# EAGLE design wifi-test (EAGLE 6.2)
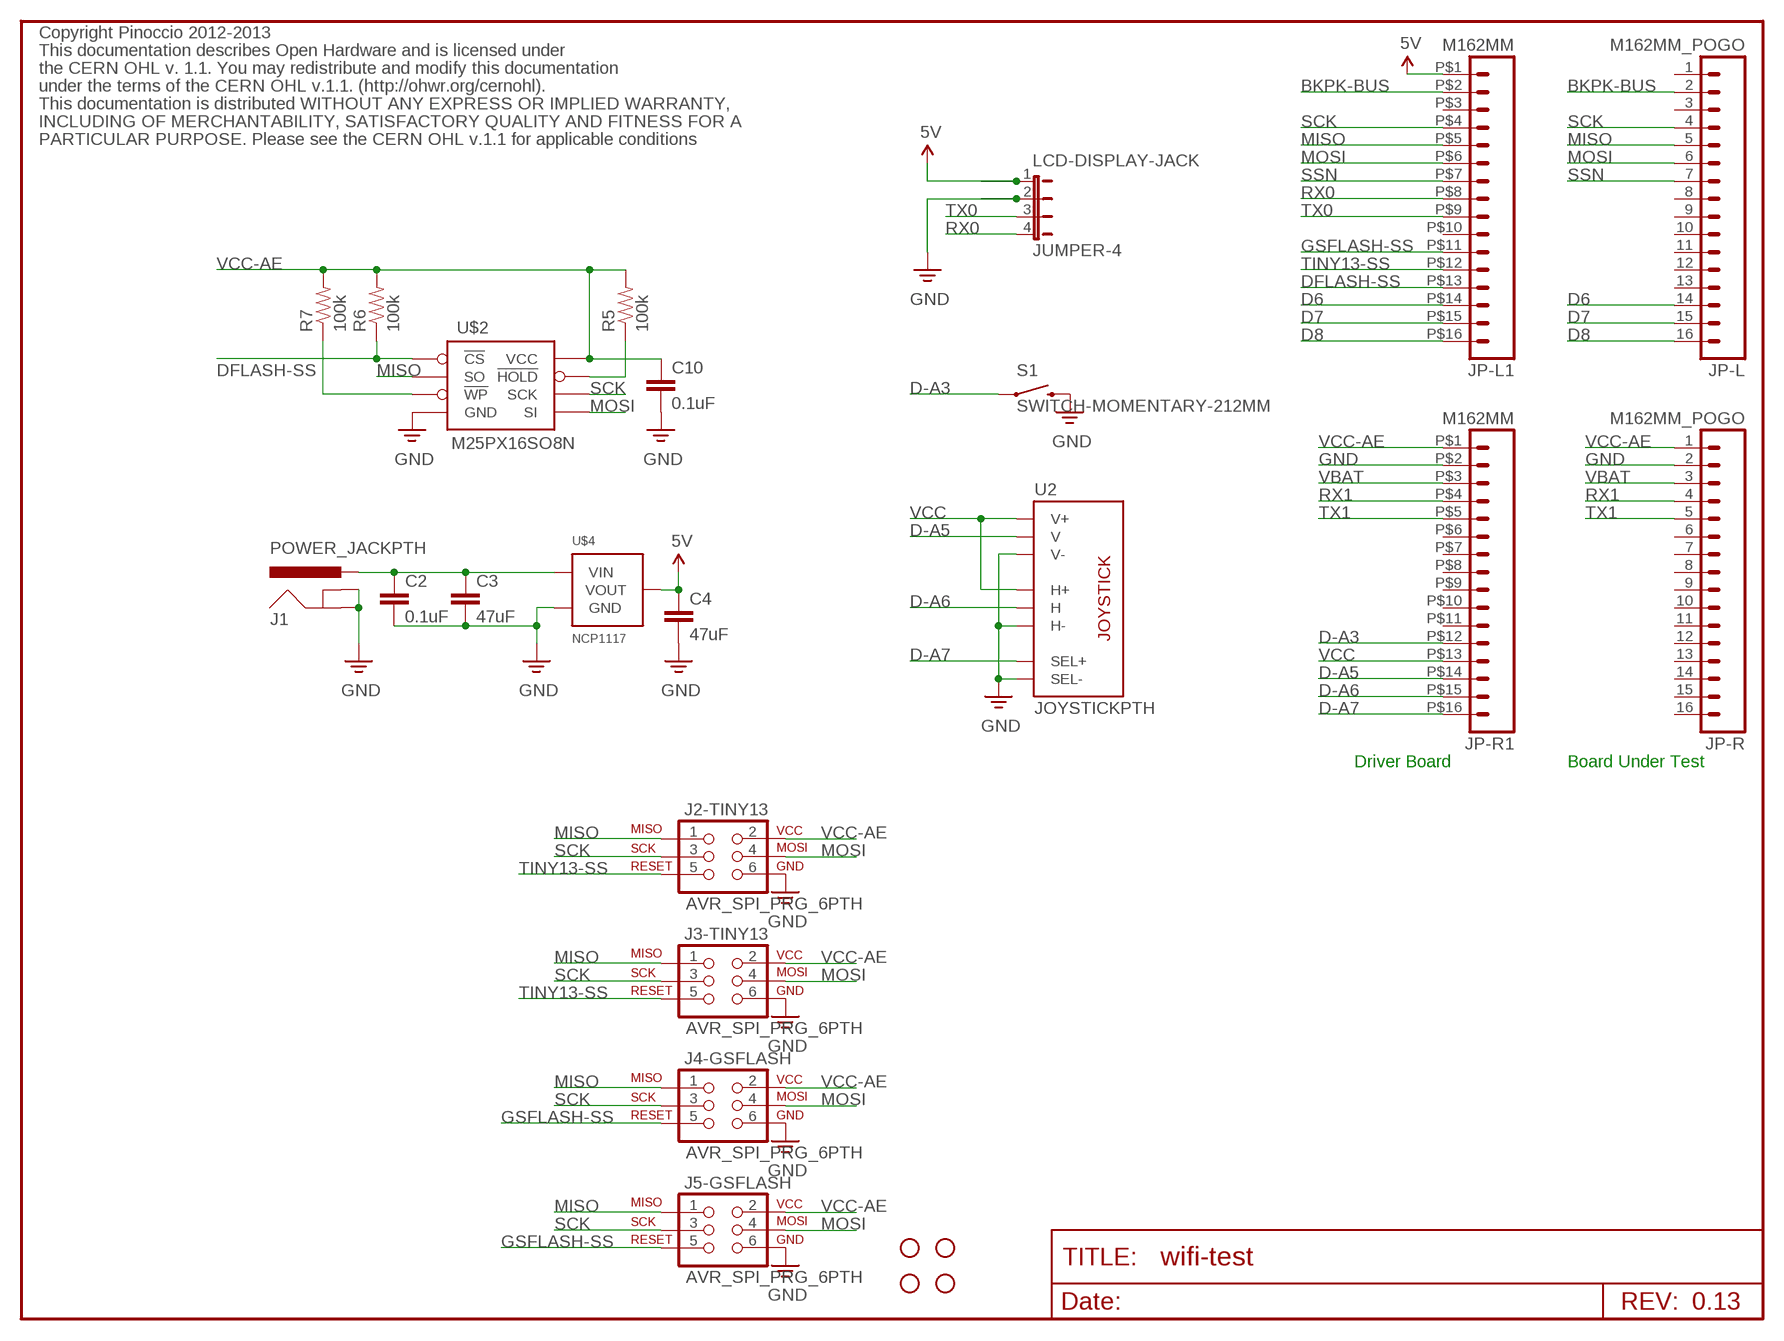
[diagram p0: schematic, sheet 1]

## Parts
C2  0.1uF  CAP0402-CAP  [0402-CAP]
C3  47uF  CAP0805  [0805]
C4  47uF  CAP0805  [0805]
C10  0.1uF  CAP0402-CAP  [0402-CAP]
J1  POWER_JACKPTH  [POWER_JACK_PTH]
J2-TINY13  AVR_SPI_PRG_6PTH  [2X3]
J3-TINY13  AVR_SPI_PRG_6PTH  [2X3]
J4-GSFLASH  AVR_SPI_PRG_6PTH  [2X3]
J5-GSFLASH  AVR_SPI_PRG_6PTH  [2X3]
JP7  STAND-OFF  [STAND-OFF]
JP9  STAND-OFF  [STAND-OFF]
JP10  STAND-OFF  [STAND-OFF]
JP12  STAND-OFF  [STAND-OFF]
JP-L  M162MM_POGO  [1X16_2MM_POGO]
JP-L1  M162MM  [1X16_2MM]
JP-R  M162MM_POGO  [1X16_2MM_POGO]
JP-R1  M162MM  [1X16_2MM]
LCD-DISPLAY-JACK  JUMPER-4  [1X04]
R5  100k  RESISTOR0402-RES  [0402-RES]
R6  100k  RESISTOR0402-RES  [0402-RES]
R7  100k  RESISTOR0402-RES  [0402-RES]
S1  SWITCH-MOMENTARY-212MM  [TACTILE-PTH-12MM]
U2  JOYSTICKPTH  [JOYSTICK]
U$2  M25PX16SO8N  [SO8N]
U$4  NCP1117  [SOT223]

## Nets
5V: C4.1 JP-L1.P$1 LCD-DISPLAY-JACK.1 U$4.2(VOUT) U$4.4(VOUT)
BKPK-BUS: JP-L1.P$2 JP-L.2
D6: JP-L1.P$14 JP-L.14
D7: JP-L1.P$15 JP-L.15
D8: JP-L1.P$16 JP-L.16
D-A3: JP-R1.P$12 S1.1
D-A5: JP-R1.P$14 U2.V2(V)
D-A6: JP-R1.P$15 U2.H2(H)
D-A7: JP-R1.P$16 U2.B1A(SEL+)
DFLASH-SS: JP-L1.P$13 R6.1 U$2.1(!CS)
GND: C2.2 C3.2 C4.2 C10.2 J1.GND J1.GNDBREAK J2-TINY13.6 J3-TINY13.6 J4-GSFLASH.6 J5-GSFLASH.6 JP-R1.P$2 JP-R.2 LCD-DISPLAY-JACK.2 S1.3 U2.B2A(SEL-) U2.H3(H-) U2.V3(V-) U$2.4(GND) U$4.1(GND)
GSFLASH-SS: J4-GSFLASH.5 J5-GSFLASH.5 JP-L1.P$11
MISO: J2-TINY13.1 J3-TINY13.1 J4-GSFLASH.1 J5-GSFLASH.1 JP-L1.P$5 JP-L.5 U$2.2(SO)
MOSI: J2-TINY13.4 J3-TINY13.4 J4-GSFLASH.4 J5-GSFLASH.4 JP-L1.P$6 JP-L.6 U$2.5(SI)
N$4: C2.1 C3.1 J1.PWR U$4.3(VIN)
N$19: R7.1 U$2.3(!WP)
N$20: R5.1 U$2.7(!HOLD)
RX0: JP-L1.P$8 LCD-DISPLAY-JACK.4
RX1: JP-R1.P$4 JP-R.4
SCK: J2-TINY13.3 J3-TINY13.3 J4-GSFLASH.3 J5-GSFLASH.3 JP-L1.P$4 JP-L.4 U$2.6(SCK)
SSN: JP-L1.P$7 JP-L.7
TINY13-SS: J2-TINY13.5 J3-TINY13.5 JP-L1.P$12
TX0: JP-L1.P$9 LCD-DISPLAY-JACK.3
TX1: JP-R1.P$5 JP-R.5
VBAT: JP-R1.P$3 JP-R.3
VCC: JP-R1.P$13 U2.H1(H+) U2.V1(V+)
VCC-AE: C10.1 J2-TINY13.2 J3-TINY13.2 J4-GSFLASH.2 J5-GSFLASH.2 JP-R1.P$1 JP-R.1 R5.2 R6.2 R7.2 U$2.8(VCC)
Unconnected: JP-L1.P$3 JP-L1.P$10 JP-L.1 JP-L.3 JP-L.8 JP-L.9 JP-L.10 JP-L.11 JP-L.12 JP-L.13 JP-R1.P$6 JP-R1.P$7 JP-R1.P$8 JP-R1.P$9 JP-R1.P$10 JP-R1.P$11 JP-R.6 JP-R.7 JP-R.8 JP-R.9 JP-R.10 JP-R.11 JP-R.12 JP-R.13 JP-R.14 JP-R.15 JP-R.16

## Notes on the sheet
- Copyright Pinoccio 2012-2013
- This documentation describes Open Hardware and is licensed under
- the CERN OHL v. 1.1. You may redistribute and modify this documentation
- under the terms of the CERN OHL v.1.1. (http://ohwr.org/cernohl).
- This documentation is distributed WITHOUT ANY EXPRESS OR IMPLIED WARRANTY,
- INCLUDING OF MERCHANTABILITY, SATISFACTORY QUALITY AND FITNESS FOR A
- PARTICULAR PURPOSE. Please see the CERN OHL v.1.1 for applicable conditions
- Driver Board | Board Under Test
- 0.13
- /Volumes/Data/Users/eric/Desktop/pinoccio.bmp
- /Volumes/Data/Users/eric/Desktop/pinoccio-1in.bmp | /Volumes/Data/Users/eric/Desktop/pinoccio-full-3-4in.bmp | /Volumes/Data/Users/eric/Desktop/pinoccio-full-3-4in.bmp

## Library data of the parts
C2-C4 C10 = Pinoccio:CAP: Capacitor Standard 0603 ceramic capacitor, and 0.1" leaded capacitor.
J1 = Pinoccio:POWER_JACK: Power Jack This is the standard 5.5mm barrel jack for power. The PTH is the most common, proven, reliable, footprint. All others are experimental. The Slot footprint only works if the mill layer is transmitted to the PCB fab house so be warned. Spark Fun Electronics SKU : PRT-00119. Mating wall wart : TOL-00298 (and others)
J2-TINY13 J3-TINY13 J4-GSFLASH J5-GSFLASH = Pinoccio:AVR_SPI_PRG_6: AVR ISP 6 Pin This is the reduced ISP connector for AVR programming. Common on Arduino. This footprint will take up less PCB space and can be used with a 10-pin to 6-pin adapter such as SKU: BOB-08508
JP7 JP9 JP10 JP12 = Pinoccio:STAND-OFF: Stand Off This is the mechanical footprint for a #4 phillips button head screw. Use the keepout ring to avoid running the screw head into surrounding components. SKU : PRT-00447
JP-L JP-L1 JP-R JP-R1 = Pinoccio:M16
LCD-DISPLAY-JACK = Pinoccio:JUMPER-4
R5-R7 = Pinoccio:RESISTOR: Resistor Basic schematic elements and footprints for 0603, 1206, and PTH resistors.
S1 = Pinoccio:SWITCH-MOMENTARY-2
U2 = Pinoccio:JOYSTICK: Thumb Joystick Joystick commonly found in PS2 controllers. Two pots and a select switch. Footprint proven. Spark Fun Electronics SKU : COM-09032
U$2 = Pinoccio:M25PX16
U$4 = Pinoccio:NCP1117: NCP1117 LDO Regulator

## Net classes
0 Default: width 0.203 mm
1 VCC: width 0.305 mm
2 LEDPower: width 0.203 mm
3 ButtonSignal: width 0.203 mm
4 RF Antenna: width 0.305 mm
5 GND: width 0.203 mm

## Board
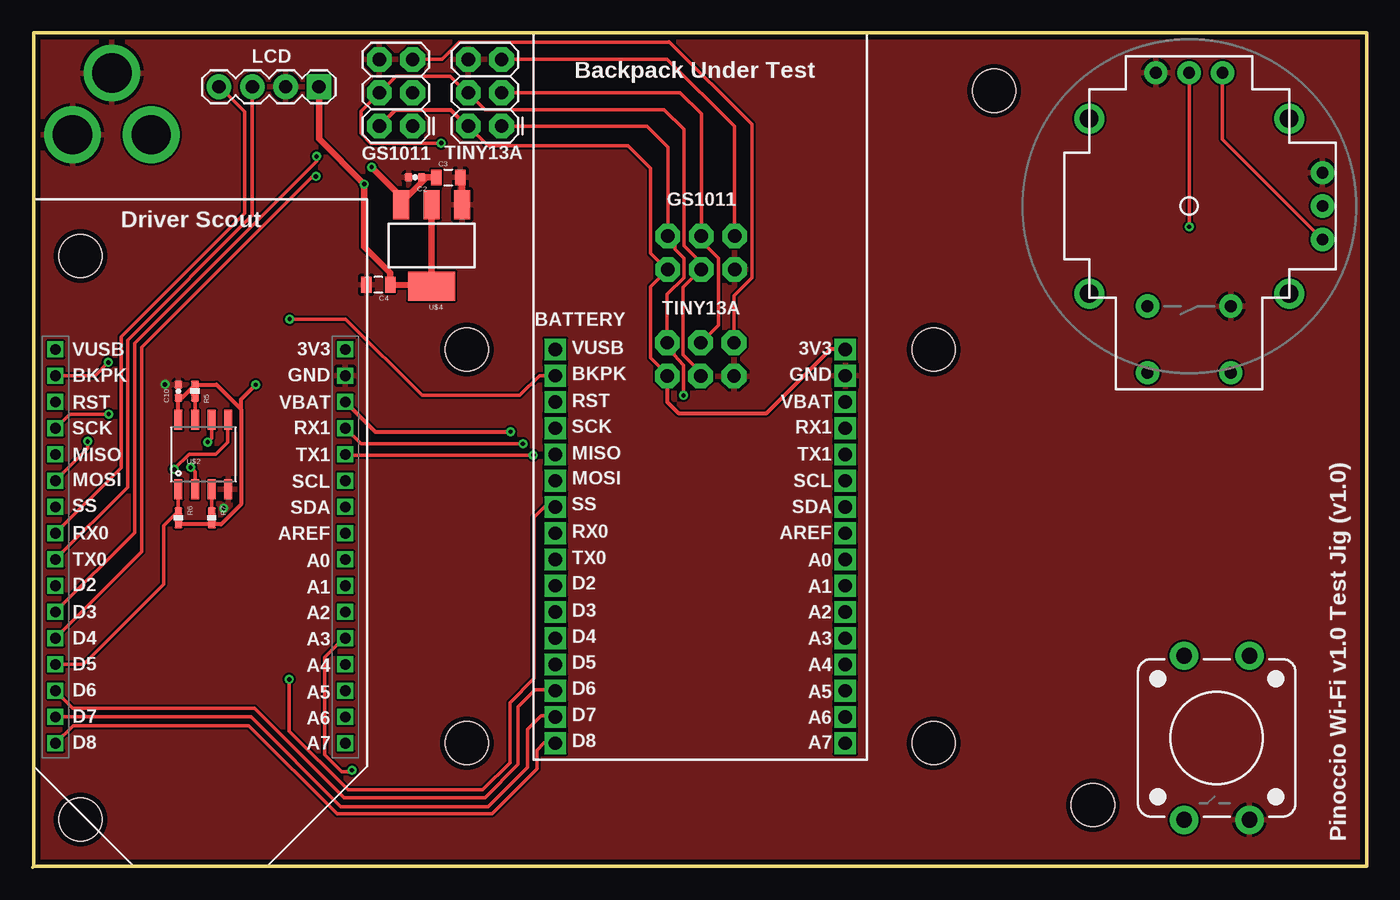
[diagram p1: board, top side]
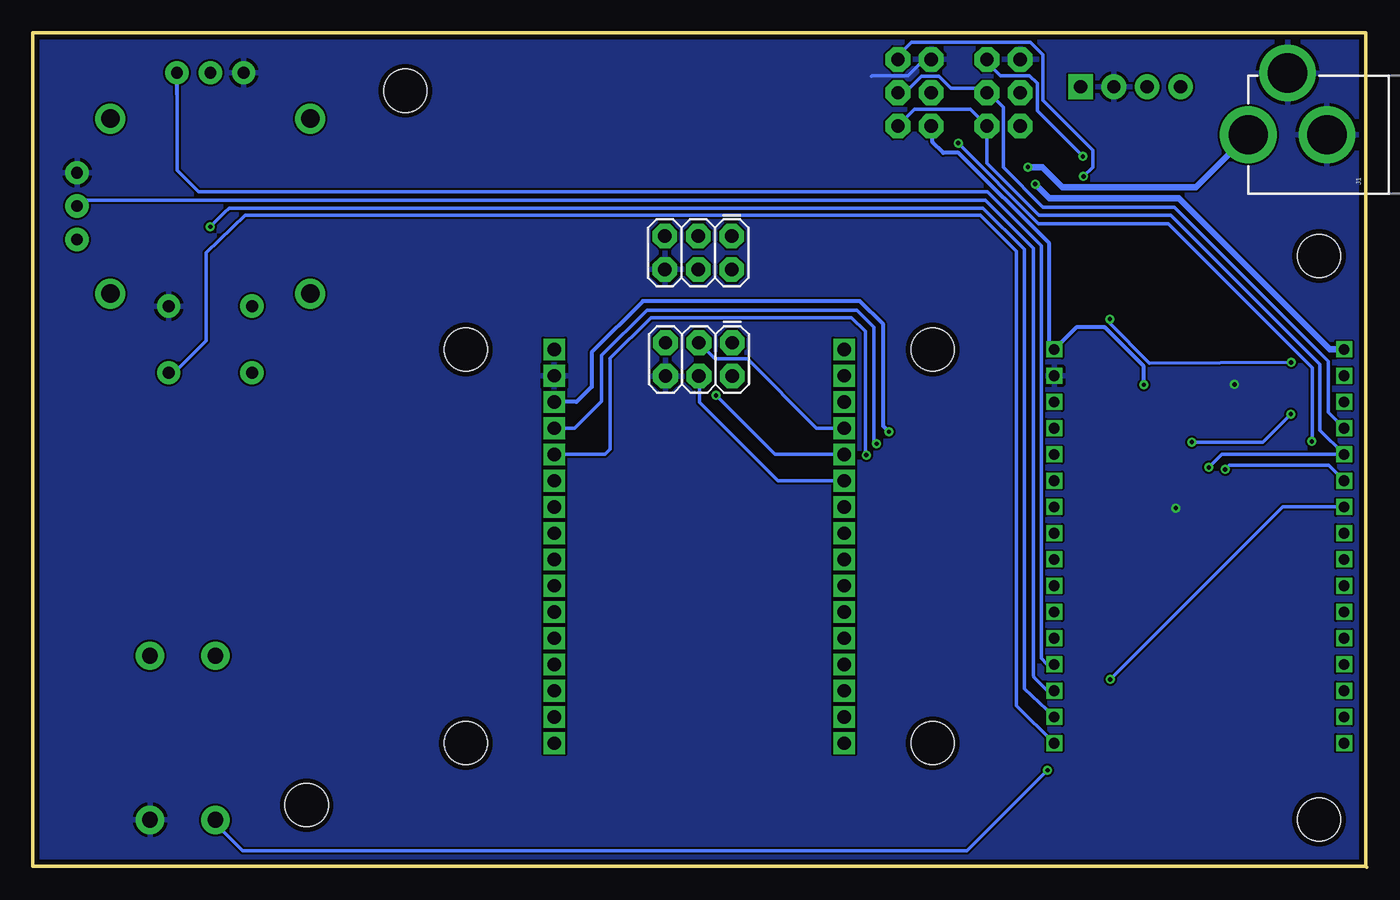
[diagram p2: board, bottom side, seen from below]

Size 101.68 x 63.58 mm. Coordinates in mm from the lower left corner, seen from the top.
Outline: 0,0 0.08,0.08
Outline: 0.08,0.08 101.68,0.08 101.68,63.58 0.08,63.58 0.08,0.08
Copper layers (1*16): Top 0.0356mm / dielectric 1.5011mm / Bottom 0.0356mm
Design rules: minimum track width 6mil, minimum drill 13mil, track to track 6mil, track to pad 6mil, pad to pad 6mil, via to via 6mil, smd to smd 6mil, copper to edge 15mil, drill to drill 6mil, minimum pad ring 7mil, minimum via ring 7mil, stop-mask expansion 4mil, vias tented up to drill 16mil, thermal gap 10mil

### Footprints (pad centres in the part's own frame; a part is rotated, then mirrored left to right if it is on the bottom)
0402-CAP = smd 0.6 x 0.6: 1 -0.5,0; 2 0.5,0
0805 = smd 0.8 x 1.2: 1 -0.9,0; 2 0.9,0
POWER_JACK_PTH = drill 2.997 pad 4.318: GND 0,7.7; GNDBREAK 4.7,10.7; PWR 0,13.7
2X3 = drill 1.016 pad 1.88 octagon: 1 0,0; 2 0,2.54; 3 2.54,0; 4 2.54,2.54; 5 5.08,0; 6 5.08,2.54
STAND-OFF = hole 3.302: 0,0
1X16_2MM_POGO = drill 1.016 pad 1.651 square: 1 0,0; 2 2,0; 3 4,0; 4 6,0; 5 8,0; 6 10,0; 7 12,0; 8 14,0; 9 16,0; 10 18,0; 11 20,0; 12 22,0; 13 24,0; 14 26,0; 15 28,0; 16 30,0
1X16_2MM = drill 0.813 square: P$1 0,0; P$2 2,0; P$3 4,0; P$4 6,0; P$5 8,0; P$6 10,0; P$7 12,0; P$8 14,0; P$9 16,0; P$10 18,0; P$11 20,0; P$12 22,0; P$13 24,0; P$14 26,0; P$15 28,0; P$16 30,0
1X04 = drill 1.016 pad 1.88 square: 1 0,0 | drill 1.016 pad 1.88: 2 2.54,0; 3 5.08,0; 4 7.62,0
0402-RES = smd 0.6 x 0.6: 1 -0.5,0; 2 0.5,0
TACTILE-PTH-12MM = drill 1.2 pad 2.159: 1 6.25,-2.5; 2 -6.25,-2.5; 3 6.25,2.5; 4 -6.25,2.5
JOYSTICK = drill 0.9 pad 1.778: B1A -3.175,12.7; B1B 3.175,12.7; B2A -3.175,7.62; B2B 3.175,7.62 | drill 0.889 pad 1.778: H1 -2.54,-10.16; H2 0,-10.16; H3 2.54,-10.16; V1 -10.16,2.54; V2 -10.16,0; V3 -10.16,-2.54 | drill 1.397 pad 2.286: MOUNT1 -7.62,6.668; MOUNT2 -7.62,-6.668; MOUNT3 7.62,-6.668; MOUNT4 7.62,6.668
SO8N = smd 0.61 x 1.524: 1 -1.905,-2.678; 2 -0.635,-2.678; 3 0.635,-2.678; 4 1.905,-2.678; 5 1.905,2.621; 6 0.635,2.621; 7 -0.635,2.621; 8 -1.905,2.621
SOT223 = smd 1.219 x 2.235: 1 -2.311,-3.099; 2 0,-3.099; 3 2.311,-3.099 | smd 3.6 x 2.2: 4 0,3.099

### Placement (x,y rotation side)
C2  29.13,52.57 180 top
C3  31.67,52.55 0 top
C4  26.34,44.37 180 top
C10  11.1,36.27 90 top
J1  -4.67,55.8 90 bottom
J2-TINY13  35.74,56.46 90 top
J3-TINY13  48.41,48.08 180 bottom
J4-GSFLASH  48.36,39.95 180 bottom
J5-GSFLASH  28.96,56.46 90 top
JP7  68.66,39.45 0 top
JP8  STAND-OFF  [STAND-OFF]  33.1,39.45 0 top
JP9  33.1,9.45 0 top
JP10  68.66,9.45 0 top
JP11  STAND-OFF  [STAND-OFF]  3.63,46.56 0 top
JP12  3.63,3.63 0 top
JP13  STAND-OFF  [STAND-OFF]  73.28,59.16 0 top
JP14  STAND-OFF  [STAND-OFF]  80.8,4.72 0 top
JP-L  39.83,39.45 270 top
JP-L1  1.73,39.45 270 top
JP-R  61.93,39.45 270 top
JP-R1  23.83,39.45 270 top
LCD-DISPLAY-JACK  21.82,59.46 180 top
R5  12.37,36.27 90 top
R6  11.1,26.62 270 top
R7  13.64,26.62 270 top
S1  90.25,9.86 270 top
U2  88.14,50.37 180 top
U$2  13,31.47 0 top
U$4  30.4,47.37 180 top

### Tracks (layer width: path | path; a pad name or v marks a point on that pad's centre or on a via)
5V  (via drill 0.33)
  Top 0.305: 30.47,44.34 U$4.4
  Top 0.508: LCD-DISPLAY-JACK.1 21.82,55.5 v25.27,52.04 25.27,47.27 27.24,45.3 C4.1 30.32,44.36 U$4.4 U$4.2
  Bottom 0.508: JP-L1.P$1 2.82,39.45 2.82,39.47 14.33,50.98 24.21,50.98 v25.27,52.04
BKPK-BUS  (via drill 0.33)
  Top 0.254: JP-L.2 38.61,37.45 37.11,35.94 29.67,35.94 23.85,41.76 v19.58,41.76 | JP-L1.P$2 4.76,37.45 v5.77,38.46
  Bottom 0.254: v5.77,38.46 16.56,38.41 19.63,41.48 | 19.63,41.48 19.71,41.55 | v19.58,41.76 19.63,41.71 19.63,41.48
D6
  Top 0.254: JP-L.14 39.76,13.51 38.28,13.51 37.01,12.24 37.01,7.85 34.47,5.31 23.72,5.31 16.92,12.12 3.06,12.12 JP-L1.P$14
D7
  Top 0.254: JP-L1.P$15 16.65,11.45 23.47,4.62 34.72,4.62 37.72,7.62 37.72,10.52 38.74,11.53 39.74,11.53 JP-L.15
D8
  Top 0.254: JP-L.16 39.8,9.47 38.99,9.47 38.43,8.92 38.43,7.49 35,4.06 23.19,4.06 16.46,10.8 3.08,10.8 JP-L1.P$16
D-A3  (via drill 0.33)
  Top 0.254: JP-R1.P$12 23.69,17.45 22.25,16 22.25,8.59 23.55,7.29 24.23,7.29 v24.33,7.39
  Bottom 0.254: v24.33,7.39 30.48,1.24 85.67,1.24 87.75,3.32 S1.1
D-A5
  Bottom 0.254: JP-R1.P$14 24.34,13.45 25.39,14.47 | 25.39,14.47 25.3,14.4 | U2.V2 97.84,50.83 79.25,50.83 69.65,50.83 29.06,50.83 25.4,47.17 25.4,14.63 25.39,14.47
D-A6  (via drill 0.33)
  Top 0.254: v88.14,48.79 U2.H2
  Bottom 0.254: JP-R1.P$15 26.11,13.61 26.11,47.07 29.26,50.22 86.72,50.22 87.08,49.85 v88.14,48.79
D-A7
  Bottom 0.254: JP-R1.P$16 26.7,12.32 26.7,46.94 29.44,49.68 85.5,49.68 88.47,46.81 88.47,40.11 90.91,37.67 U2.B1A
DFLASH-SS
  Top 0.254: U$2.1 R6.1 9.98,26 9.98,21.56 3.86,15.45 JP-L1.P$13
GND  (via drill 0.33)
  Top 0.508: C3.2 32.72,52.41 U$4.1
  Bottom 0.254: J2-TINY13.6 33.73,61.54 34.98,60.3 37.72,60.3 37.77,60.25
  other vias: 14.55,27.36 10.08,36.78
  pour Bottom: 0.2,63.4 101.47,63.4 101.47,0.3 0.2,0.3 0.2,63.22
  pour Top: 0.25,63.45 101.55,63.45 101.55,0.3 0.3,0.3 0.3,63.35
GSFLASH-SS  (via drill 0.33 pad 0.25)
  Top 0.254: JP-L1.P$11 7.77,25.49 7.77,39.9 21.64,53.77 v21.64,54.15 | J4-GSFLASH.5 53.44,43.54 54.81,44.91 54.81,56.59 48.51,62.89 48.46,62.84 32.51,62.84 31.22,61.54 J5-GSFLASH.5
  Bottom 0.254: v21.64,54.15 25.12,57.63 25.12,59.72 25.71,60.3 27.91,60.3 28.96,61.34 J5-GSFLASH.5
MISO  (via drill 0.33, 0.33 pad 0.25)
  Top 0.254: U$2.2 12.37,30.12 v12.04,30.45 | J2-TINY13.1 46.81,56.46 48.41,54.86 J3-TINY13.1 48.95,47.55 48.95,47.09 49.63,46.41 49.63,44.91 48.36,43.64 J4-GSFLASH.1 48.87,39.45 48.87,39.04 49.61,38.25 v49.61,35.94
  Bottom 0.254: v12.04,30.45 11.05,31.45 JP-L1.P$5 3.58,33.3 3.58,38.33 14.94,49.68 24.99,49.68 28.96,53.65 J5-GSFLASH.1 28.96,56.49 30.2,57.73 34.47,57.73 J2-TINY13.1 | JP-L.5 45.09,31.45 v49.61,35.94
MOSI  (via drill 0.33, 0.33 pad 0.25)
  Top 0.254: v10.8,30.3 10.8,30.35 11.91,31.47 13.94,31.47 14.86,32.39 14.86,34.04 U$2.5 | v31.14,55.17 25.76,55.17 25.02,55.91 25.02,57.61 J5-GSFLASH.4 27.69,60.27 31.8,60.27 33.07,59 J2-TINY13.4 34.49,57.71 48.13,57.71 49.63,56.21 49.63,47.35 50.95,46.03 J3-TINY13.4 49.58,44.17 49.58,39.04 50.9,37.72 J4-GSFLASH.4 | JP-L1.P$6 4.19,31.91 v4.19,32.44
  Bottom 0.254: v10.8,30.3 10.49,30.61 2.89,30.61 JP-L1.P$6 | v31.14,55.17 25.04,49.02 15.14,49.02 4.17,38.05 4.17,32.46 v4.19,32.44 | JP-L.6 44.86,29.45 50.85,35.43 50.85,37.36 J4-GSFLASH.4
N$4  (via drill 0.33 pad 0.25)
  Top 0.254: 30,52.55 29.65,52.55 C2.1
  Top 0.508: 28.07,50.47 U$4.3 | U$4.3 28.01,50.56 30,52.55 C3.1 | v25.83,53.34 28.09,51.08 U$4.3
  Bottom 0.508: J1.PWR 13.01,51.82 23.19,51.82 24.71,53.34 v25.83,53.34
N$19
  Top 0.254: U$2.3 R7.1
N$20
  Top 0.254: R5.1 U$2.7
RX0
  Top 0.254: JP-L1.P$8 6.73,30.45 6.73,40.41 16.15,49.84 16.15,57.56 14.25,59.46 LCD-DISPLAY-JACK.4
RX1  (via drill 0.33 pad 0.25)
  Top 0.254: JP-R1.P$4 25.01,32.26 v37.36,32.26
  Bottom 0.254: v37.36,32.26 37.57,32.46 37.57,41.15 38.86,42.44 54.86,42.44 58.32,38.99 58.32,35.51 60.38,33.45 JP-R.4
SCK  (via drill 0.33)
  Top 0.254: U$2.6 13.64,32.69 v13.34,32.39 | JP-L1.P$4 2.8,34.52 v5.79,34.52 | J2-TINY13.3 49.35,59 50.95,57.4 J3-TINY13.3 50.95,47.68 52.25,46.38 52.25,41.3 J4-GSFLASH.3
  Bottom 0.254: JP-L1.P$4 2.95,34.67 2.95,38.56 14.68,50.29 24.69,50.29 27.71,53.31 27.71,57.91 28.8,59 J5-GSFLASH.3 29.31,59.36 31.7,59.36 32.61,60.27 33.93,60.27 35.1,59.11 35.64,59.11 J2-TINY13.3 35.74,59.13 | v13.34,32.39 7.93,32.39 v5.79,34.52 | JP-L.4 41.93,33.45 47.22,38.74 49.68,38.74 J4-GSFLASH.3 51.28,40.34
SSN  (via drill 0.33)
  Top 0.254: 39.77,27.51 JP-L.7 | v19.56,14.3 19.56,10.36 24.03,5.89 34.29,5.89 36.37,7.98 36.37,12.55 38.2,14.38 38.2,26.64 39.22,27.66 39.61,27.66 JP-L.7 | 39.82,27.46 JP-L.7
  Bottom 0.254: JP-L1.P$7 6.41,27.45 v19.56,14.3
TINY13-SS  (via drill 0.33 pad 0.25)
  Top 0.254: JP-L1.P$12 8.31,24.03 8.31,39.6 21.34,52.63 v21.59,52.63 | J3-TINY13.5 53.49,56.44 48.36,61.57 35.76,61.57 J2-TINY13.5
  Bottom 0.254: v21.59,52.63 20.88,53.34 20.88,54.64 24.69,58.45 24.69,61.9 25.63,62.84 34.72,62.84 35.74,61.82 J2-TINY13.5
TX0
  Top 0.254: JP-L1.P$9 7.24,28.96 7.24,40.16 16.74,49.66 LCD-DISPLAY-JACK.3
TX1  (via drill 0.33 pad 0.25)
  Top 0.254: JP-R1.P$5 23.88,31.39 v38.15,31.39
  Bottom 0.254: v38.15,31.39 38.23,31.47 38.23,40.82 39.27,41.86 54.56,41.86 57.66,38.76 57.66,31.85 58.06,31.45 JP-R.5
VBAT  (via drill 0.33 pad 0.25)
  Top 0.305: JP-R1.P$3 26.1,33.17 v36.42,33.17
  Bottom 0.305: v36.42,33.17 36.86,33.6 36.86,41.35 38.63,43.13 55.17,43.13 59.08,39.22 59.08,36.6 60.24,35.45 JP-R.3
VCC
  Top 0.254: U2.V1 90.68,55.45 U2.H1
  Bottom 0.254: 90.7,58.9 90.7,60.5 U2.H1 90.68,53.11 89.51,51.94 89.03,51.46 28.93,51.46 24.82,47.35 24.82,15.9 24.36,15.45 JP-R1.P$13
VCC-AE  (via drill 0.33)
  Top 0.254: 13.67,26.09 13.65,26.11 | J2-TINY13.2 34.7,54.97 45.36,54.97 47.09,53.24 47.09,46.76 48.31,45.54 J3-TINY13.2 47.09,44.22 47.09,38.81 48.36,37.54 J4-GSFLASH.2
  Top 0.305: U$2.8 C10.1 11.37,35.77 R5.2 14,36.77 15.88,34.9 | 15.88,34.9 15.88,27.64 14.35,26.11 13.65,26.11 | 13.65,26.11 R7.2 | 13.65,26.11 11.11,26.11 R6.2 | 15.88,34.9 15.88,35.64 v16.99,36.75 | J5-GSFLASH.2 27.66,57.71 31.85,57.71 33.1,56.46 J2-TINY13.2 | J4-GSFLASH.2 48.36,35.46 49.23,34.6 55.93,34.6 60.83,39.5 61.87,39.5 JP-R.1
  Bottom 0.305: v16.99,36.75 16.99,38.15 19.96,41.12 22.15,41.12 JP-R1.P$1 24.21,39.83 24.21,47.52 31.12,54.43 32.28,54.43 33.1,55.25 33.1,56.36 J2-TINY13.2

### Text on the board
tPlace: LCD | Backpack Under Test | GS1011 | TINY13A | GS1011 | Driver Scout | BATTERY | TINY13A | 3V3 | 3V3 | VUSB | VUSB | GND | GND | BKPK | BKPK | VBAT | VBAT | RST | RST | RX1 | RX1 | SCK | SCK | TX1 | TX1 | MISO | MISO | SCL | SCL | MOSI | MOSI | SDA | SDA | SS | SS | AREF | AREF | RX0 | RX0 | A0 | A0 | TX0 | TX0 | A1 | A1 | D2 | D2 | A2 | A2 | D3 | D3 | A3 | A3 | D4 | D4 | A4 | A4 | D5 | D5 | A5 | A5 | D6 | D6 | A6 | A6 | D7 | D7 | A7 | A7 | D8 | D8 | Pinoccio Wi-Fi v1.0 Test Jig (v1.0)
tDocu: Pinoccio(tm) Wi-Fi Test Jig v1.0 | Design by: Eric Jennings for Pinoccio | http://pinocc.io | Licensed under CERN OHL v.1.1